# Altium schematic sheet Current Sense.SchDoc: Vsense from 0 to 69.3V
size Letter; Date: 2017-02-08; DocumentNumber: 15; Revision: A; SheetNumber: 15; SheetTotal: 16; DesignedBy: Mike MacKay
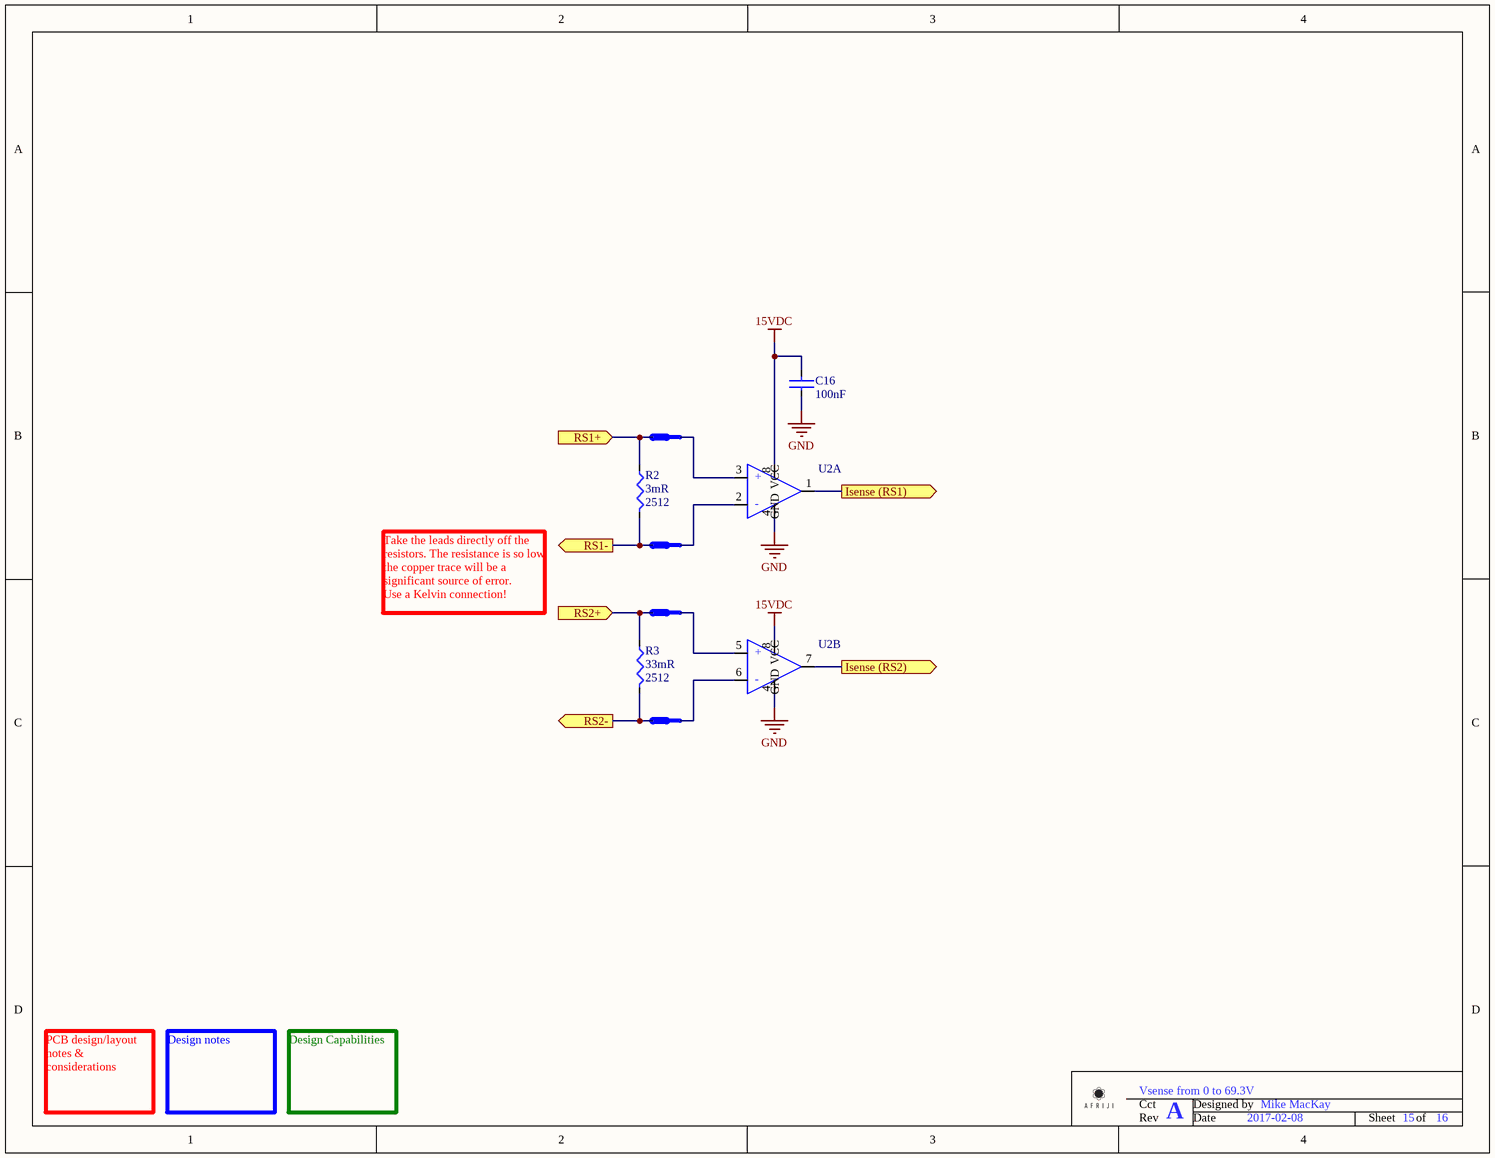
[diagram p0: Current Sense.SchDoc]

## Parts
C16  Capacitance: 100nF  [C0603 - Ceramic]  (hidden comment: 100nF 0603 50V)
NetTie3  Net Tie  [Net tie (7/35 mil)]  (value not drawn)  (net tie, no BOM)
NetTie4  Net Tie  [Net tie (7/7 mil)]  (value not drawn)  (net tie, no BOM)
NetTie5  Net Tie  [Net tie (7/35 mil)]  (value not drawn)  (net tie, no BOM)
NetTie6  Net Tie  [Net tie (7/7 mil)]  (value not drawn)  (net tie, no BOM)
R2  Resistance (Ohms): 3mR  Supplier Device Package: 2512  [R2512]  (hidden comment: 3mR 2512 1%)
R3  Resistance (Ohms): 33mR  Supplier Device Package: 2512  [R2512]  (hidden comment: 33mR 2512 1%)
U2  Dual High Side Current Sense Amplifier  [SOIC-8 (3.9mm)]  (value not drawn)  (parts A,B of 2)

## Ports
Isense (RS1) (out), Isense (RS2) (out), RS1+ (in), RS1- (out), RS2+ (in), RS2- (out)

## Nets
15VDC: C16.1 U2.8(VCC)
GND: C16.2 U2.4(GND)
Isense (RS1): U2.1(Out) ; port Isense (RS1)
Isense (RS2): U2.7(OUT2) ; port Isense (RS2)
RS1+: NetTie3.2 R2.2 ; port RS1+
RS1-: NetTie4.2 R2.1 ; port RS1-
RS2+: NetTie5.2 R3.2 ; port RS2+
RS2-: NetTie6.2 R3.1 ; port RS2-
NetNetTie3_1: NetTie3.1 U2.3(RS1+)
NetNetTie4_1: NetTie4.1 U2.2(RS1-)
NetNetTie5_1: NetTie5.1 U2.5(RS2+)
NetNetTie6_1: NetTie6.1 U2.6(RS2-)

## Notes on the sheet
- Take the leads directly off the resistors. The resistance is so low the copper trace will be a significant source of error.
  Use a Kelvin connection!
- PCB design/layout notes & considerations
- Design notes
- Design Capabilities
- Cct
- Designed by
- Rev
- Date
- Sheet
- of
- (in symbol Dual High Side Current Sense Amplifier, part A) +
- (in symbol Dual High Side Current Sense Amplifier, part B) +

## Library data of the parts
C16 = 100nF 0603 50V: Manufacturer: Samsung Electro-Mechanics America, Inc; Manufacturer Part Number: CL10B104KB8SFNC; Tolerance: ±10%; Temperature Coefficient: X7R; Value: 100nF 0603 50V; Supplier 1: Digi-Key; RoHS: RoHS Compliant; Category: Capacitors; Stock 1: 1192070; Pricing 1: 1=0.1, 10=0.027, 25=0.0192, 100=0.0125, 500=0.00874, 1000=0.00681 (USD); Packaging: Cut Tape (CT); Voltage - Rated: 50V; Mounting Type: Surface Mount, MLCC; Operating Temperature: -55°C ~ 125°C; Applications: Boardflex Sensitive; Ratings: -; Package / Case: 0603 (1608 Metric); Size / Dimension: 0.063" L x 0.031" W (1.60mm x 0.80mm); Height - Seated (Max): -; Thickness (Max): 0.035" (0.90mm); Lead Spacing: -; Features: Soft Termination; Lead Style: -; ComponentLink1URL: http://www.samsungsem.com/kr/front/downloadcms.do?path=/kr/support/product-search/mlcc/__icsFiles/afieldfile/2014/11/05&fileName=S_CL10B104KB8SFNC.pdf; ComponentLink1Description: http://www.samsungsem.com/kr/front/downloadcms.do?path=/kr/support/product-search/mlcc/__icsFiles/afieldfile/2014/11/05&fileName=S_CL10B104KB8SFNC.pdf; Supplier Part Number 1: 1276-1936-1-ND
NetTie3-NetTie6 = Net Tie: Ties two nets together
R2 = 3mR 2512 1%: Manufacturer: Yageo; Manufacturer Part Number: PR2512FKF070R003L; Power (Watts): 1W; Temperature Coefficient: ±100ppm/°C; Value: 3mR 2512 1%; Supplier 1: Digi-Key; Supplier Part Number 1: 311-0.003AGCT-ND; RoHS: RoHS Compliant; Category: Resistors; Stock 1: 16866; Pricing 1: 1=0.65, 10=0.544, 25=0.466, 50=0.4196, 100=0.3652, 250=0.32632, 500=0.26416, 1000=0.21366 (USD); Packaging: Cut Tape (CT); Part Status: Active; Tolerance: ±1%; Composition: Thick Film; Features: Current Sense; Operating Temperature: -55°C ~ 170°C; Package / Case: 2512 (6432 Metric); Size / Dimension: 0.252" L x 0.126" W (6.40mm x 3.20mm); Height - Seated (Max): 0.041" (1.03mm); Number of Terminations: 2; Failure Rate: -; ComponentLink1URL: http://www.yageo.com/NewPortal/yageodocoutput?fileName=/pdf/R-Chip/-PYu-PR_51_RoHS_Z_0.pdf; ComponentLink1Description: Spec Sheet
R3 = 33mR 2512 1%: Manufacturer: Yageo; Manufacturer Part Number: RL2512FK-070R033L; Power (Watts): 1W; Temperature Coefficient: ±1200ppm/°C; Value: 3mR 2512 1%; Supplier 1: Digi-Key; Supplier Part Number 1: 311-.033TCT-ND; RoHS: RoHS Compliant; Category: Resistors; Stock 1: 13739; Pricing 1: 1=0.61, 10=0.453, 25=0.3676, 50=0.3196, 100=0.2636, 250=0.229, 500=0.1864, 1000=0.14784 (USD); Packaging: Cut Tape (CT); Part Status: Active; Tolerance: ±1%; Composition: Thick Film; Features: Automotive AEC-Q200, Current Sense, Moisture Resistant; Operating Temperature: -55°C ~ 155°C; Package / Case: 2512 (6432 Metric); Size / Dimension: 0.250" L x 0.126" W (6.35mm x 3.20mm); Height - Seated (Max): 0.026" (0.65mm); Number of Terminations: 2; Failure Rate: -; ComponentLink1URL: http://www.yageo.com/documents/recent/PYu-RL_Group_521_RoHS_L%201.pdf; ComponentLink1Description: http://www.yageo.com/documents/recent/PYu-RL_Group_521_RoHS_L%201.pdf
U2 = Dual High Side Current Sense Amplifier: Manufacturer: Maxim Integrated; Manufacturer Part Number: MAX4377FASA+; Number of Circuits: 2; Slew Rate: 10 V/µs; -3db Bandwidth: 1.7MHz; Current - Input Bias: 800µA; Current - Supply: 1mA; Voltage - Supply, Single/Dual (±): 3 V ~ 28 V; Supplier 1: Digi-Key; RoHS: RoHS Compliant; Category: Integrated Circuits (ICs); Stock 1: 695; Pricing 1: 1=1.98, 10=1.881, 50=1.8742 (USD); Packaging: Tube; Part Status: Active; Amplifier Type: Current Sense; Output Type: -; Gain Bandwidth Product: -; Voltage - Input Offset: -; Current - Output / Channel: -; Operating Temperature: -40°C ~ 125°C; Mounting Type: Surface Mount; Package / Case: 8-SOIC (0.154", 3.90mm Width); Supplier Device Package: 8-SOIC; ComponentLink1URL: https://datasheets.maximintegrated.com/en/ds/MAX4376-MAX4378.pdf; ComponentLink1Description: Spec Sheet; Supplier Part Number 1: MAX4377FASA+-ND